# EAGLE design Drucksensor (EAGLE 5.11)
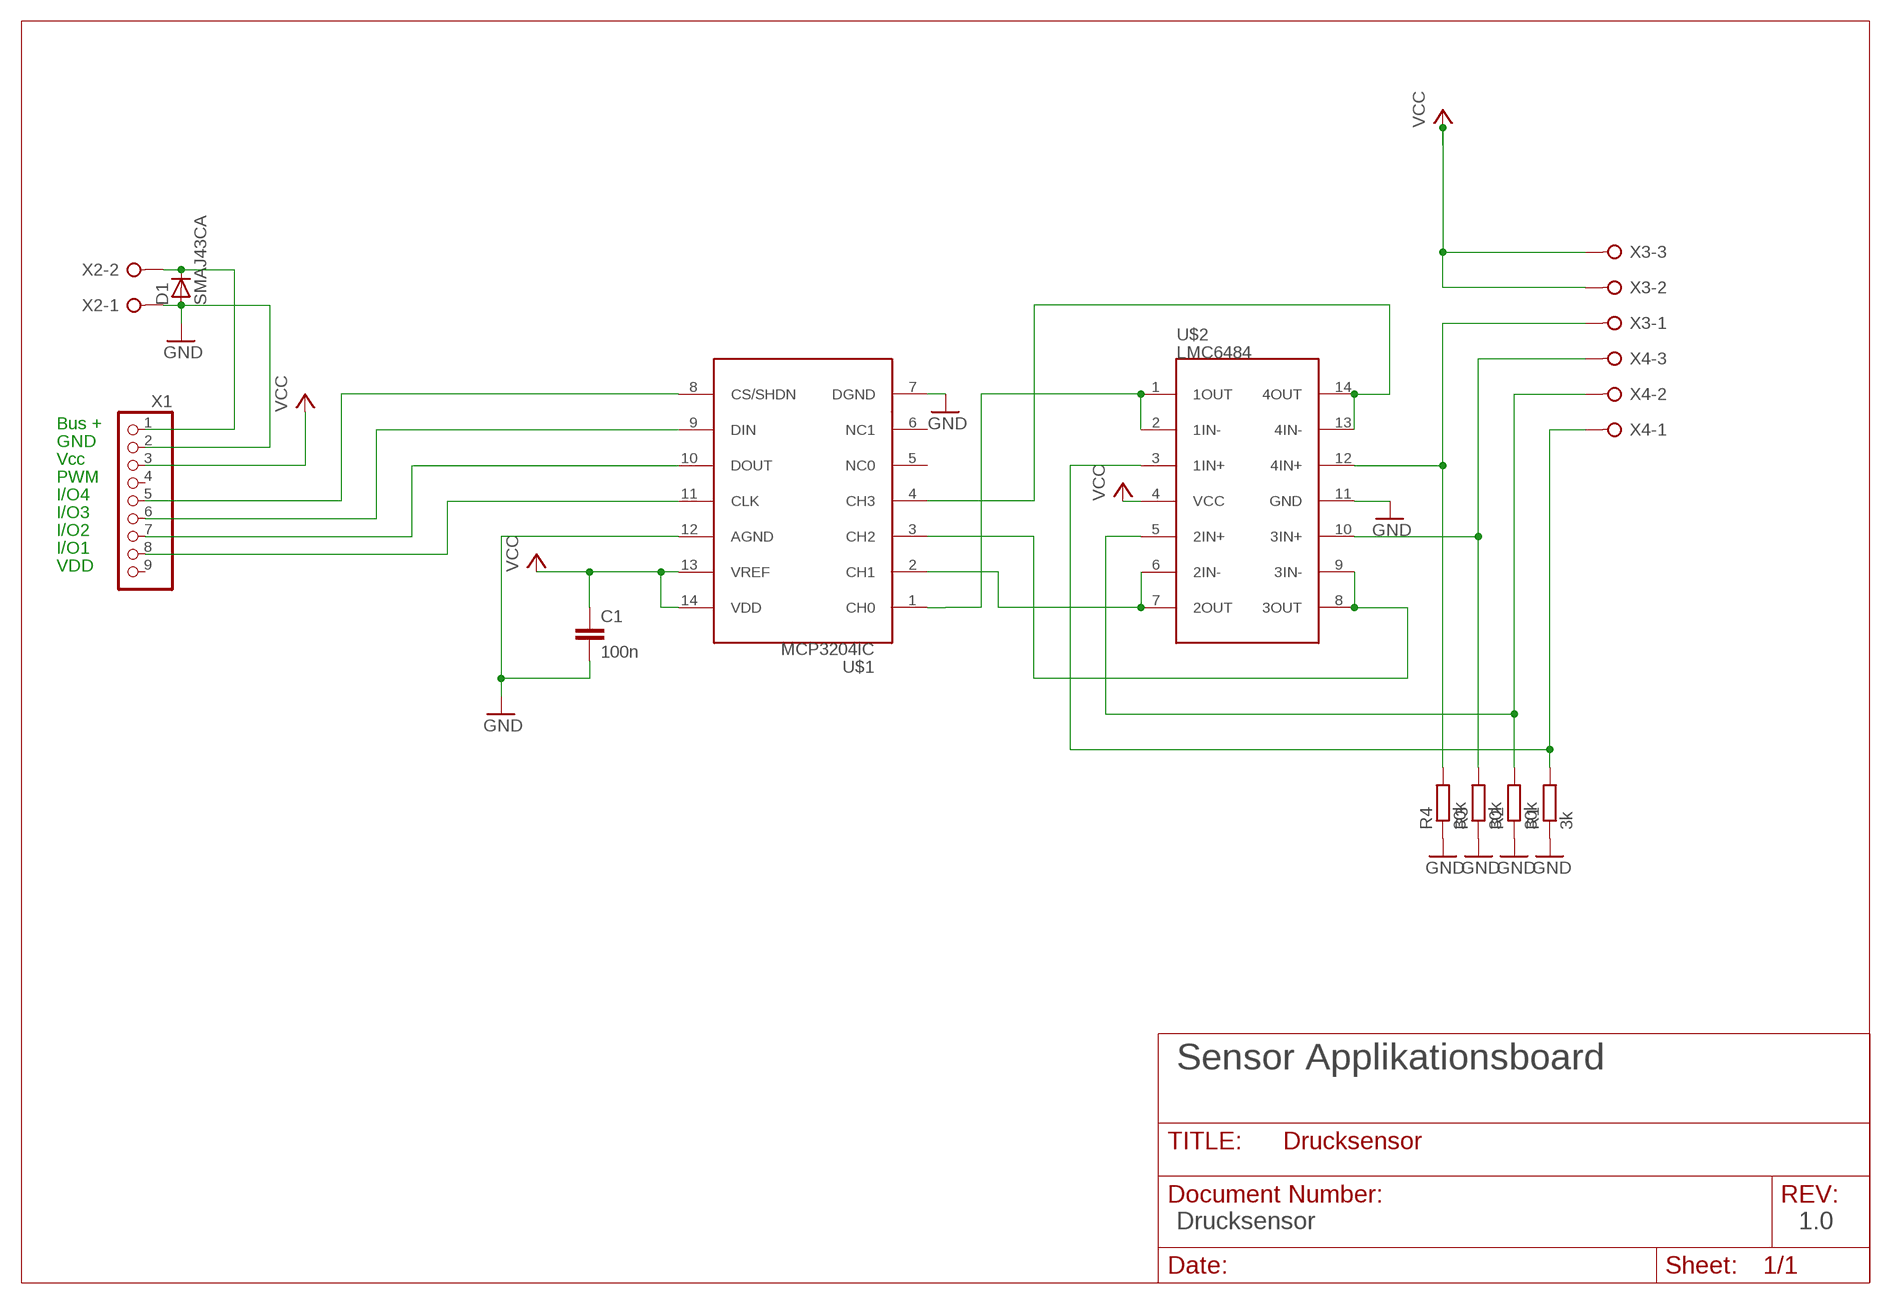
[diagram p0: schematic, sheet 1]

## Parts
C1  100n  C-EU025-024X044  [C025-024X044]
D1  SMAJ43CA  D-SMB  [SMB]
R1  3k  R-EU_0204/7  [0204/7]
R2  30k  R-EU_0204/7  [0204/7]
R3  30k  R-EU_0204/7  [0204/7]
R4  30k  R-EU_0204/7  [0204/7]
U$1  MCP3204IC  MCP3204  [DIL14]
U$2  LMC6484  [DIL14]
X1  PINHD-1X9  [1X09]
X2  W237-02P  [W237-132]
X3  W237-3E  [W237-3E]
X4  W237-3E  [W237-3E]

## Nets
GND: C1.2 D1.2(A) R1.1 R2.1 R3.1 R4.1 U$1.7(DGND) U$1.12(AGND) U$2.11(GND) X1.2 X2.1
N$1: U$1.11(CLK) X1.8
N$2: U$1.10(DOUT) X1.7
N$3: U$1.9(DIN) X1.6
N$4: U$1.8(CS/SHDN) X1.5
N$5: D1.1(C) X1.1 X2.2
N$7: U$1.2(CH1) U$2.6(2IN-) U$2.7(2OUT)
N$8: U$1.3(CH2) U$2.8(3OUT) U$2.9(3IN-)
N$9: U$1.4(CH3) U$2.13(4IN-) U$2.14(4OUT)
N$10: R1.2 U$2.3(1IN+) X4.1
N$11: R2.2 U$2.5(2IN+) X4.2
N$12: R3.2 U$2.10(3IN+) X4.3
N$13: R4.2 U$2.12(4IN+) X3.1
N$16: U$1.1(CH0) U$2.1(1OUT) U$2.2(1IN-)
VCC: C1.1 U$1.13(VREF) U$1.14(VDD) U$2.4(VCC) X1.3 X3.2 X3.3
Unconnected: U$1.5(NC0) U$1.6(NC1) X1.4 X1.9

## Notes on the sheet
- Bus +
- GND
- Vcc
- PWM
- I/O4
- I/O3
- I/O2
- I/O1
- VDD
- Sensor Applikationsboard
- Drucksensor | 1.0

## Library data of the parts
C1 = rcl:C-EU: CAPACITOR, European symbol
D1 = semicon-smd-ipc:D-: DIODE unfilled
R1-R4 = rcl:R-EU_: RESISTOR, European symbol
U$1 = MCP3204:MCP3204
U$2 = LMC6484:LMC6484
X1 = pinhead:PINHD-1X9: PIN HEADER
X2 = con-wago-508:W237-02P: WAGO SREW CLAMP; OC_FARNELL: unknown; OC_NEWARK: unknown
X3 X4 = con-wago-508:W237-3E: WAGO SREW CLAMP; OC_FARNELL: unknown; OC_NEWARK: unknown

## Board
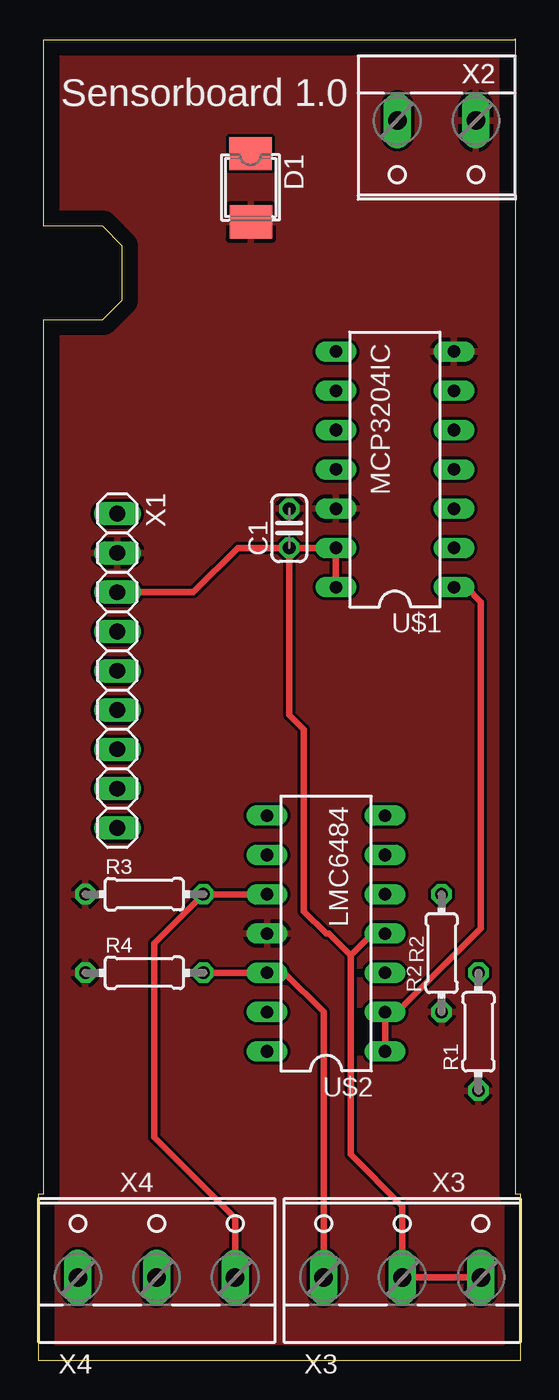
[diagram p1: board, top side]
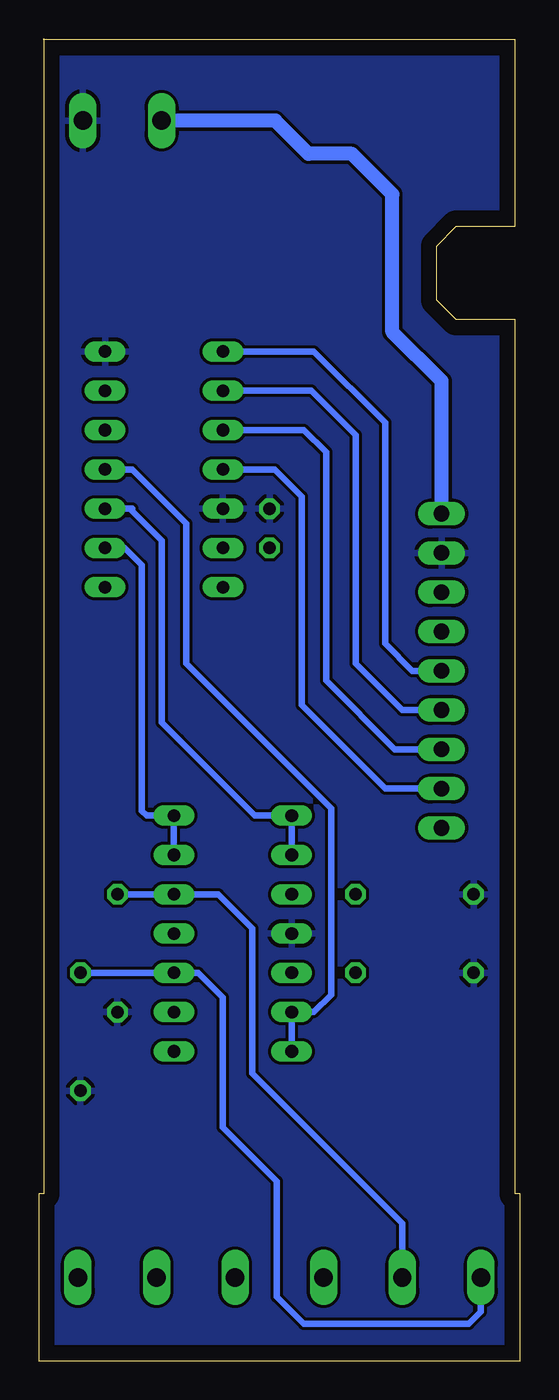
[diagram p2: board, bottom side, seen from below]

Size 31.11 x 85.47 mm. Coordinates in mm from the lower left corner, seen from the top.
Outline: 0,0 0,10.79 0.32,10.79 0.32,67.31 4.13,67.31 5.4,68.58 5.4,72.07 4.13,73.34 0.32,73.34 0.32,85.41 30.8,85.41 30.8,85.47 30.8,10.79 31.11,10.79 31.11,0 0,0
Copper layers (1*16): Top 0.035mm / dielectric 1.5mm / Bottom 0.035mm
Design rules "default": minimum track width 10mil, minimum drill 24mil, track to track 8mil, track to pad 8mil, pad to pad 8mil, via to via 8mil, smd to smd 8mil, copper to edge 40mil, drill to drill 8mil, minimum pad ring 10mil, minimum via ring 8mil, stop-mask expansion 4mil, vias tented up to drill 0mil, thermal gap 10mil

### Footprints (pad centres in the part's own frame; a part is rotated, then mirrored left to right if it is on the bottom)
C025-024X044 = drill 0.813 octagon: 1 -1.27,0; 2 1.27,0
SMB = smd 2.159 x 2.743: 1 -2.311,-0.127; 2 2.108,-0.102
0204/7 = drill 0.813 octagon: 1 -3.81,0; 2 3.81,0
DIL14 = drill 0.813 long: 1 -7.62,-3.81; 2 -5.08,-3.81; 3 -2.54,-3.81; 4 0,-3.81; 5 2.54,-3.81; 6 5.08,-3.81; 7 7.62,-3.81; 8 7.62,3.81; 9 5.08,3.81; 10 2.54,3.81; 11 0,3.81; 12 -2.54,3.81; 13 -5.08,3.81; 14 -7.62,3.81
1X09 = drill 1.016 long: 1 -10.16,0; 2 -7.62,0; 3 -5.08,0; 4 -2.54,0; 5 0,0; 6 2.54,0; 7 5.08,0; 8 7.62,0; 9 10.16,0
W237-132 = drill 1.194 long: 1 -2.54,-0.635; 2 2.54,-0.635
W237-3E = drill 1.194 long: 1 -5.08,-0.635; 2 0,-0.635; 3 5.08,-0.635

### Placement (x,y rotation side)
C1  16.19,53.82 90 top
D1  13.81,75.72 270 top
R1  28.42,21.27 90 top
R2  26.04,26.35 90 top
R3  6.83,30.16 0 top
R4  6.83,25.08 0 top
U$1  23.02,57.63 90 top
U$2  18.57,27.62 90 top
X1  5.08,44.61 270 top
X2  25.72,79.53 180 top
X3  23.49,6.03 0 top
X4  7.62,6.03 0 top

### Tracks (layer width: path | path; a pad name or v marks a point on that pad's centre or on a via)
GND
  pour Bottom: 0,0 0,10.79 0.32,10.79 0.32,67.31 4.13,67.31 5.4,68.58 5.4,72.07 4.13,73.34 0.32,73.34 0.32,85.41 30.73,85.41 30.8,85.47 30.8,10.79 31.11,10.79 31.11,0
  pour Top: 0,0 0,10.79 0.32,10.79 0.32,67.31 4.13,67.31 5.4,68.58 5.4,71.91 5.4,72.07 4.13,73.34 0.32,73.34 0.32,85.41 30.8,85.41 30.8,10.79 31.11,10.79 31.11,0
N$1
  Bottom 0.406: U$1.11 15.87,57.63 14.13,55.88 14.13,42.39 8.73,36.99 X1.8
N$2
  Bottom 0.406: U$1.10 13.97,60.17 12.54,58.74 12.54,43.97 8.1,39.53 X1.7
N$3
  Bottom 0.406: U$1.9 13.49,62.71 10.64,59.85 10.64,45.09 7.62,42.07 X1.6
N$4
  Bottom 0.406: U$1.8 13.34,65.25 8.73,60.64 8.73,46.36 6.99,44.61 X1.5
N$5  (1 unrouted)
  Bottom 0.406: X1.1
  Bottom 0.914: X2.2 15.82,80.17 D1.1 10.88,78.03 8.26,75.41 8.26,66.52 5.08,63.34 X1.1
N$7
  Bottom 0.406: U$1.2 25.56,52.55 24.45,51.44 24.45,35.56 24.13,35.24 U$2.7 U$2.6
N$8
  Bottom 0.406: U$1.3 25.08,55.09 25.08,54.93 23.18,53.02 23.18,41.28 22.07,40.16 17.15,35.24 U$2.8 U$2.9
N$9
  Bottom 0.406: U$1.4 25.08,57.63 21.59,54.13 21.59,45.09 12.22,35.72 12.22,23.65 13.34,22.54 U$2.13 U$2.14
N$10
  Bottom 0.406: U$2.3 R1.2 | U$2.3 | U$2.3 20.8,25.08 19.21,23.49 19.21,15.08 15.72,11.59 15.72,4.13 13.97,2.38 3.33,2.38 2.54,3.17 X4.1
N$11
  Bottom 0.406: X4.2 7.62,8.89 17.3,18.57 17.3,27.94 19.53,30.16 U$2.5 R2.2
N$12
  Top 0.406: X4.3 12.7,9.21 7.46,14.45 7.46,26.99 R3.2 U$2.10
  Bottom 0.406: R3.2
N$13
  Top 0.406: X3.1 18.42,22.22 18.42,22.54 15.87,25.08 U$2.12 R4.2
N$16
  Top 0.406: U$1.1 27.62,50.01 28.58,49.05 28.58,27.94 23.18,22.54 U$2.2 U$2.1
VCC
  Top 0.406: X1.3 10,49.69 12.86,52.55 C1.1 | C1.1 | C1.1 U$1.13 | U$1.13 | U$1.13 U$1.14 | C1.1 16.19,50.16 16.19,41.75 17.15,40.8 17.15,29.05 18.57,27.62 18.73,27.62 20.16,26.19 | C1.1 | X3.3 X3.2 23.49,10 20.16,13.34 20.16,26.19 | U$2.4 21.59,27.62 20.16,26.19

### Text on the board
_tsilk: X2 | Sensorboard 1.0 | D1 | X1 | MCP3204IC | C1 | R3 | LMC6484 | R4 | R2 | R1 | X4 | X3